# Altium schematic sheet MCU.SchDoc: MCU
size A4; Author: NGUYEN QUANG MINH; Organization: My Company; Address1: Address Line 1; Address2: Address Line 2; Address3: Address Line 3; Address4: Address Line 4; SheetNumber: 3; SheetTotal: 5
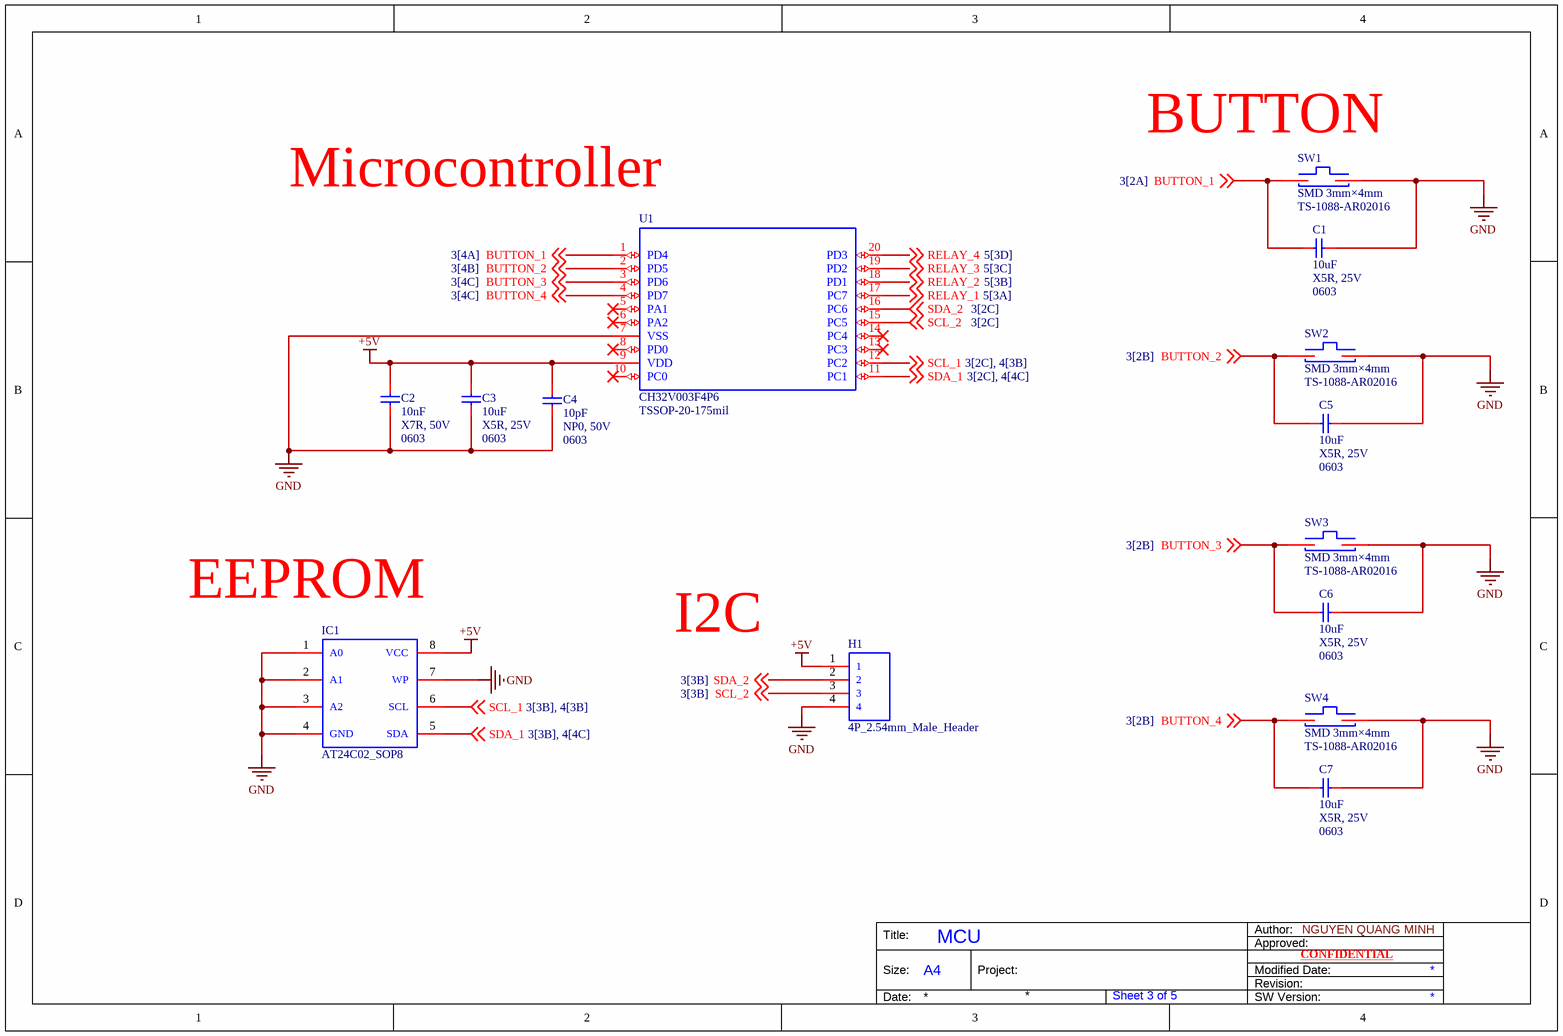
[diagram p0: MCU.SchDoc]

## Parts
C1  10uF  Temperature Coefficient: X5R, 25V  Package: 0603  [C0603]
C2  10nF  Temperature Coefficient: X7R, 50V  Package: 0603  [C0603]
C3  10uF  Temperature Coefficient: X5R, 25V  Package: 0603  [C0603]
C4  10pF  Temperature Coefficient: NP0, 50V  Package: 0603  [C0603]
C5  10uF  Temperature Coefficient: X5R, 25V  Package: 0603  [C0603]
C6  10uF  Temperature Coefficient: X5R, 25V  Package: 0603  [C0603]
C7  10uF  Temperature Coefficient: X5R, 25V  Package: 0603  [C0603]
H1  4P_2.54mm_Male_Header  [4P, 2,54mm, MALE HEADER]
IC1  AT24C02_SOP8  [SOP-8]
SW1  SMD 3mm×4mm  Mfr. Part: TS-1088-AR02016  [ROUND_BUTTON_SMD 3*4mm]
SW2  SMD 3mm×4mm  Mfr. Part: TS-1088-AR02016  [ROUND_BUTTON_SMD 3*4mm]
SW3  SMD 3mm×4mm  Mfr. Part: TS-1088-AR02016  [ROUND_BUTTON_SMD 3*4mm]
SW4  SMD 3mm×4mm  Mfr. Part: TS-1088-AR02016  [ROUND_BUTTON_SMD 3*4mm]
U1  CH32V003F4P6  Package: TSSOP-20-175mil  [TSSOP-20]

## Nets
+5V: C2.2 C3.2 C4.2 H1.1 IC1.8(VCC) U1.9(VDD)
GND: C1.2 C2.1 C3.1 C4.1 C5.2 C6.2 C7.2 H1.4 IC1.1(A0) IC1.2(A1) IC1.3(A2) IC1.4(GND) IC1.7(WP) SW1.2 SW2.2 SW3.2 SW4.2 U1.7(VSS)
BUTTON_1: C1.1 SW1.1 U1.1(PD4) ; off-sheet BUTTON_1
BUTTON_2: C5.1 SW2.1 U1.2(PD5) ; off-sheet BUTTON_2
BUTTON_3: C6.1 SW3.1 U1.3(PD6) ; off-sheet BUTTON_3
BUTTON_4: C7.1 SW4.1 U1.4(PD7) ; off-sheet BUTTON_4
RELAY_1: U1.17(PC7) ; off-sheet RELAY_1
RELAY_2: U1.18(PD1) ; off-sheet RELAY_2
RELAY_3: U1.19(PD2) ; off-sheet RELAY_3
RELAY_4: U1.20(PD3) ; off-sheet RELAY_4
SCL_1: IC1.6(SCL) U1.12(PC2) ; off-sheet SCL_1
SCL_2: H1.3 U1.15(PC5) ; off-sheet SCL_2
SDA_1: IC1.5(SDA) U1.11(PC1) ; off-sheet SDA_1
SDA_2: H1.2 U1.16(PC6) ; off-sheet SDA_2

Not connected (* = marked no-connect by the designer): U1 5(PA1)* 6(PA2)* 8(PD0)* 10(PC0)* 13(PC3)* 14(PC4)*

## Notes on the sheet
- (near SW1) BUTTON
- Microcontroller
- (near IC1) EEPROM
- I2C
- Author:
- Title:
- Size:
- A4
- Project:
- Approved:
- Revision:
- Modified Date:
- CONFIDENTIAL
- Date:
- SW Version:

## Library data of the parts
C1 C3 C5-C7 = C0603_MLCC_10uF_X5R_25V: 25V 10uF X5R ±20% 0603 Multilayer Ceramic Capacitors MLCC - SMD/SMT ROHS; Manufacturer: YAGEO; Mfr. Part: CC0603MRX5R8BB106; LCSC Part: C596327; Capacitance: 10uF; Link: https://www.lcsc.com/product-detail/C596327.html; Tolerance: ±20%; Voltage Rating: 25V
C2 = C0603_MLCC_10nF_X7R_50V: 50V 10nF X7R ±10% 0603 Multilayer Ceramic Capacitors MLCC - SMD/SMT ROHS; Manufacturer: YAGEO; Mfr. Part: CC0603KRX7R9BB103; LCSC Part: C100042; Capacitance: 10nF; Link: https://www.lcsc.com/product-detail/C100042.html; Tolerance: ±10%; Voltage Rating: 50V
C4 = C0603_MLCC_10pF_NP0_50V: 50V 10pF NP0 ±5% 0603 Multilayer Ceramic Capacitors MLCC - SMD/SMT ROHS; Manufacturer: YAGEO; Mfr. Part: CC0603JRNPO9BN100; LCSC Part: C106245; Capacitance: 10pF; Link: https://www.lcsc.com/product-detail/C106245.html; Tolerance: ±5%; Voltage Rating: 50V
H1 = 4P_2.54mm_Male_Header: 4P 1x4P -40℃~+105℃ Black Pin Header 2.54mm 2.5mm 6mm 250V 3mm 1 Through Hole Through Hole,P=2.54mm Headers, Male Pins ROHS; Manufacturer: XFCN; Mfr. Part: PZ254V-11-04P; LCSC Part: C2691448; Package: Through Hole,P=2.54mm; Holes Structure: 1x4P; Link: https://www.lcsc.com/product-detail/C2691448.html; Pitch: 2.54mm
IC1 = AT24C02_SOP8: 2Kbit 1.8V~5.5V 1MHz I2C SOP-8 Memory (ICs) ROHS; Manufacturer: IDCHIP; Key Attributes: 24C02 2K-bit Electrically Erasable PROM; Data Retention - TDR (Year): 100 Years; Write Cycle Time(tWC): 5ms; Write Cycle Endurance: 1,000,000 Cycles; Mfr. Part: AT24C02; LCSC Part: C688857; Package: SOP-8; Memory Size: 2Kbit; Voltage - Supply: 1.8V~5.5V; Clock Frequency: 1MHz; Operating Temperature: -40℃~+85℃; Interface: I2C; Link: https://www.lcsc.com/product-detail/C688857.html?s_z=n_AT24C02%2520-%2520TSSOP8
SW1-SW4 = SW_BUTTON_SMD_3mm×4mm: Without Bracket 50mA 4mm 100,000 Cycles 12V 1.6N 3mm 2mm Round Button Surface Mount,Vertical SPST SMD Tactile Switches ROHS; Manufacturer: XUNPU; LCSC Part: C720477; Package: SMD; Length: 4mm; Width: 3mm; Voltage Rating: 12V; Operating Temperature: -30℃~+80℃; Link: https://www.lcsc.com/product-detail/C720477.html?s_z=n_Button
U1 = CH32V003F4P6_TSSOP-20-175mil: TSSOP-20-175mil Microcontrollers (MCU/MPU/SOC) ROHS; Manufacturer: WCH; Mfr. Part: CH32V003F4P6; LCSC Part: C5187096; Link: https://www.lcsc.com/product-detail/C5187096.html?s_z=n_CH32V003F4P6